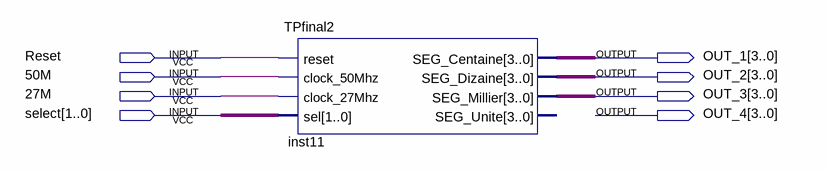
[diagram p0: schematic sheet]
// Quartus schematic Test.bdf as structural Verilog: 1 symbols, 8 pins
module Test (
  input  Reset,
  input  \50M ,
  input  \27M ,
  input  [1:0] select,
  output [3:0] OUT_1,
  output [3:0] OUT_2,
  output [3:0] OUT_3,
  output [3:0] OUT_4
);

  TPfinal2 inst11 (
    .reset(Reset), .clock_50Mhz(\50M ), .clock_27Mhz(\27M ), .sel(select), .SEG_Centaine(OUT_1),
    .SEG_Dizaine(OUT_2), .SEG_Millier(OUT_3));  // open: SEG_Unite
endmodule
